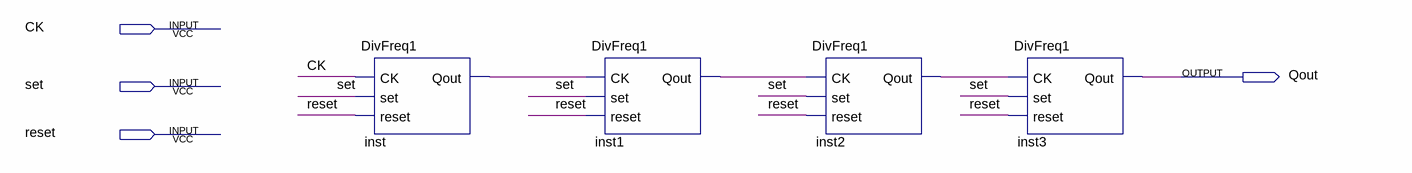
[diagram p0: schematic sheet]
// Quartus schematic DivFreq4.bdf as structural Verilog: 4 symbols, 4 pins
module DivFreq4 (
  input  CK,
  input  set,
  input  reset,
  output Qout
);

  wire inst1_qout, inst2_qout, inst_qout;

  DivFreq1 inst (.CK(CK), .set(set), .reset(reset), .Qout(inst_qout));
  DivFreq1 inst1 (.CK(inst_qout), .set(set), .reset(reset), .Qout(inst1_qout));
  DivFreq1 inst2 (.CK(inst1_qout), .set(set), .reset(reset), .Qout(inst2_qout));
  DivFreq1 inst3 (.CK(inst2_qout), .set(set), .reset(reset), .Qout(Qout));
endmodule
